# Altium schematic sheet Test_Points.SchDoc: Test Points
size A4; DocumentNumber: 2; SheetNumber: 2; SheetTotal: 4
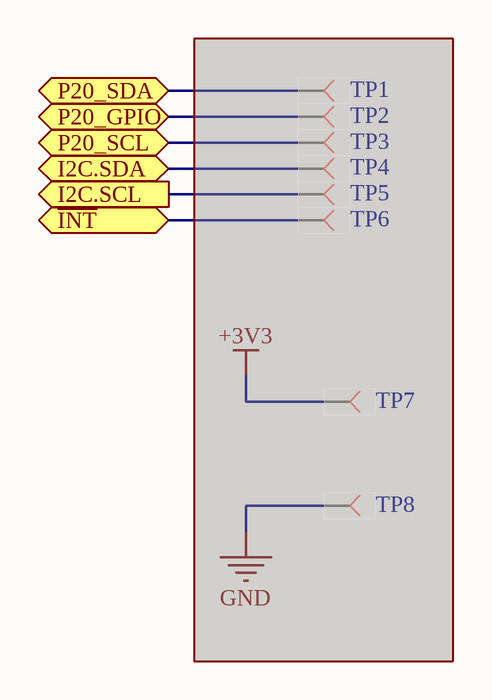
[diagram p0: Test_Points.SchDoc]

## Parts
TP1  Test Point Pad  [Testpoint]  (value not drawn)  (no BOM)  (masked out: inside a compile mask, not in the netlist)
TP2  Test Point Pad  [Testpoint]  (value not drawn)  (no BOM)  (masked out: inside a compile mask, not in the netlist)
TP3  Test Point Pad  [Testpoint]  (value not drawn)  (no BOM)  (masked out: inside a compile mask, not in the netlist)
TP4  Test Point Pad  [Testpoint]  (value not drawn)  (no BOM)  (masked out: inside a compile mask, not in the netlist)
TP5  Test Point Pad  [Testpoint]  (value not drawn)  (no BOM)  (masked out: inside a compile mask, not in the netlist)
TP6  Test Point Pad  [Testpoint]  (value not drawn)  (no BOM)  (masked out: inside a compile mask, not in the netlist)
TP7  Test Point Pad  [Testpoint]  (value not drawn)  (no BOM)  (masked out: inside a compile mask, not in the netlist)
TP8  Test Point Pad  [Testpoint]  (value not drawn)  (no BOM)  (masked out: inside a compile mask, not in the netlist)

## Ports
I2C.SCL (out), I2C.SDA (bidir), P20_GPIO, P20_SCL, P20_SDA, ~{INT}

## Notes on the sheet
- Title
- Size:
- Date:
- A4
- Number:
- Time:
- Revision:
- Sheet
- of
- File:

## Library data of the parts
TP1-TP8 = Test Point Pad: Test Point. There is nothing to buy or mount.; ClassName: TestPoint; CompType: TestPoint; Manufacturer: N/A; MountType: N/A; PackageReference: TetsPoint; PartNumber: N/A